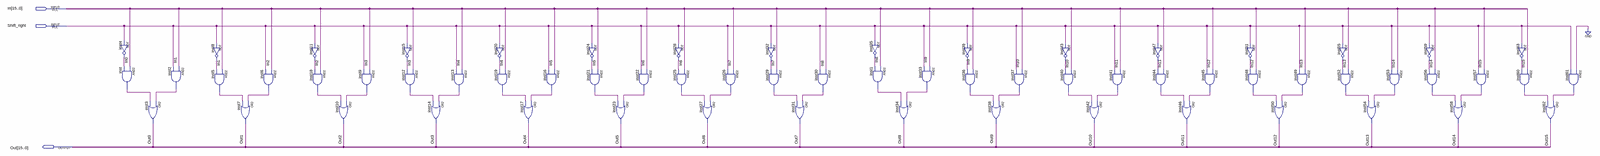
[diagram p0: schematic sheet, whole]
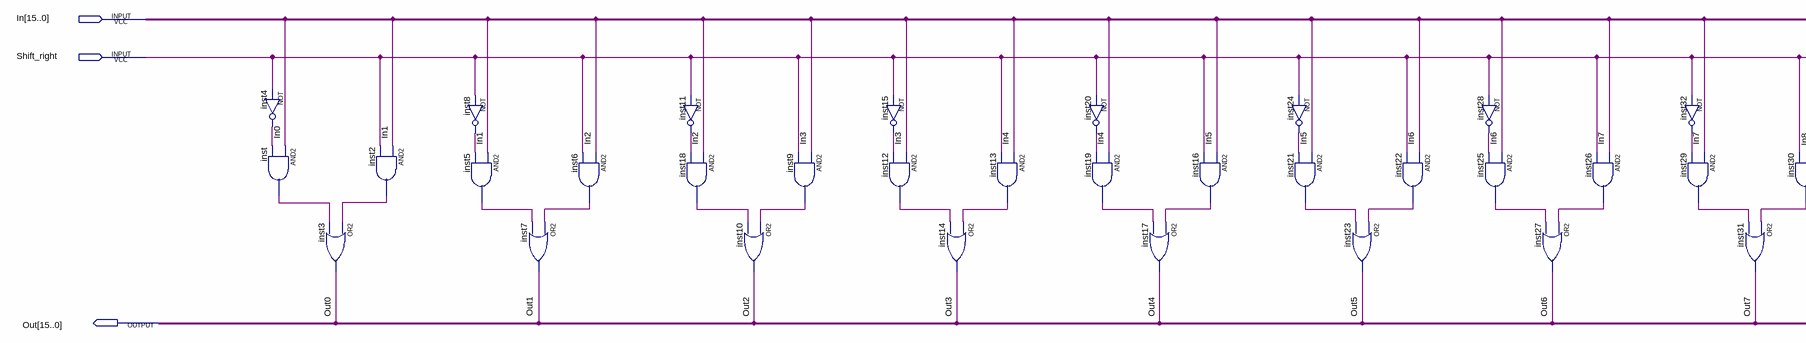
[diagram p1: schematic sheet, left part]
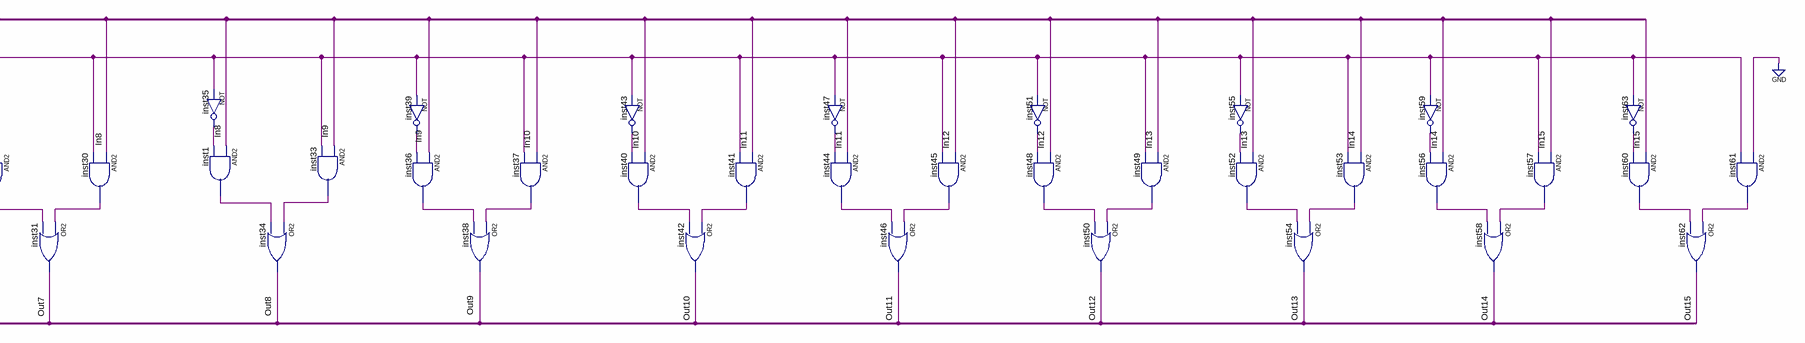
[diagram p2: schematic sheet, right part]
// Quartus schematic Shift_right_1.bdf as structural Verilog: 64 symbols, 3 pins
module Shift_right_1 (
  input  [15:0] In,
  input  Shift_right,
  output [15:0] Out
);

  wire inst1_out, inst2_out, inst4_out, inst5_out, inst6_out, inst8_out, inst9_out, inst11_out, inst12_out,
       inst13_out, inst15_out, inst16_out, inst18_out, inst19_out, inst20_out, inst21_out, inst22_out,
       inst24_out, inst25_out, inst26_out, inst28_out, inst29_out, inst30_out, inst32_out, inst33_out,
       inst35_out, inst36_out, inst37_out, inst39_out, inst40_out, inst41_out, inst43_out, inst44_out,
       inst45_out, inst47_out, inst48_out, inst49_out, inst51_out, inst52_out, inst53_out, inst55_out,
       inst56_out, inst57_out, inst59_out, inst60_out, inst61_out, inst63_out, inst_out;

  not inst4 (inst4_out, Shift_right);
  and inst (inst_out, In[0], inst4_out);
  or inst3 (Out[0], inst2_out, inst_out);
  and inst2 (inst2_out, In[1], Shift_right);
  not inst8 (inst8_out, Shift_right);
  and inst5 (inst5_out, In[1], inst8_out);
  or inst7 (Out[1], inst6_out, inst5_out);
  and inst6 (inst6_out, In[2], Shift_right);
  not inst11 (inst11_out, Shift_right);
  and inst18 (inst18_out, In[2], inst11_out);
  or inst10 (Out[2], inst9_out, inst18_out);
  and inst9 (inst9_out, In[3], Shift_right);
  not inst15 (inst15_out, Shift_right);
  and inst12 (inst12_out, In[3], inst15_out);
  or inst14 (Out[3], inst13_out, inst12_out);
  and inst13 (inst13_out, In[4], Shift_right);
  not inst20 (inst20_out, Shift_right);
  and inst19 (inst19_out, In[4], inst20_out);
  or inst17 (Out[4], inst16_out, inst19_out);
  and inst16 (inst16_out, In[5], Shift_right);
  not inst24 (inst24_out, Shift_right);
  and inst21 (inst21_out, In[5], inst24_out);
  or inst23 (Out[5], inst22_out, inst21_out);
  and inst22 (inst22_out, In[6], Shift_right);
  not inst28 (inst28_out, Shift_right);
  and inst25 (inst25_out, In[6], inst28_out);
  or inst27 (Out[6], inst26_out, inst25_out);
  and inst26 (inst26_out, In[7], Shift_right);
  not inst32 (inst32_out, Shift_right);
  and inst29 (inst29_out, In[7], inst32_out);
  or inst31 (Out[7], inst30_out, inst29_out);
  and inst30 (inst30_out, In[8], Shift_right);
  not inst35 (inst35_out, Shift_right);
  and inst1 (inst1_out, In[8], inst35_out);
  or inst34 (Out[8], inst33_out, inst1_out);
  and inst33 (inst33_out, In[9], Shift_right);
  not inst39 (inst39_out, Shift_right);
  and inst36 (inst36_out, In[9], inst39_out);
  or inst38 (Out[9], inst37_out, inst36_out);
  and inst37 (inst37_out, In[10], Shift_right);
  not inst43 (inst43_out, Shift_right);
  and inst40 (inst40_out, In[10], inst43_out);
  or inst42 (Out[10], inst41_out, inst40_out);
  and inst41 (inst41_out, In[11], Shift_right);
  not inst47 (inst47_out, Shift_right);
  and inst44 (inst44_out, In[11], inst47_out);
  or inst46 (Out[11], inst45_out, inst44_out);
  and inst45 (inst45_out, In[12], Shift_right);
  not inst51 (inst51_out, Shift_right);
  and inst48 (inst48_out, In[12], inst51_out);
  or inst50 (Out[12], inst49_out, inst48_out);
  and inst49 (inst49_out, In[13], Shift_right);
  not inst55 (inst55_out, Shift_right);
  and inst52 (inst52_out, In[13], inst55_out);
  or inst54 (Out[13], inst53_out, inst52_out);
  and inst53 (inst53_out, In[14], Shift_right);
  not inst59 (inst59_out, Shift_right);
  and inst56 (inst56_out, In[14], inst59_out);
  or inst58 (Out[14], inst57_out, inst56_out);
  and inst57 (inst57_out, In[15], Shift_right);
  not inst63 (inst63_out, Shift_right);
  and inst60 (inst60_out, In[15], inst63_out);
  or inst62 (Out[15], inst61_out, inst60_out);
  and inst61 (inst61_out, 1'b0, Shift_right);
endmodule
